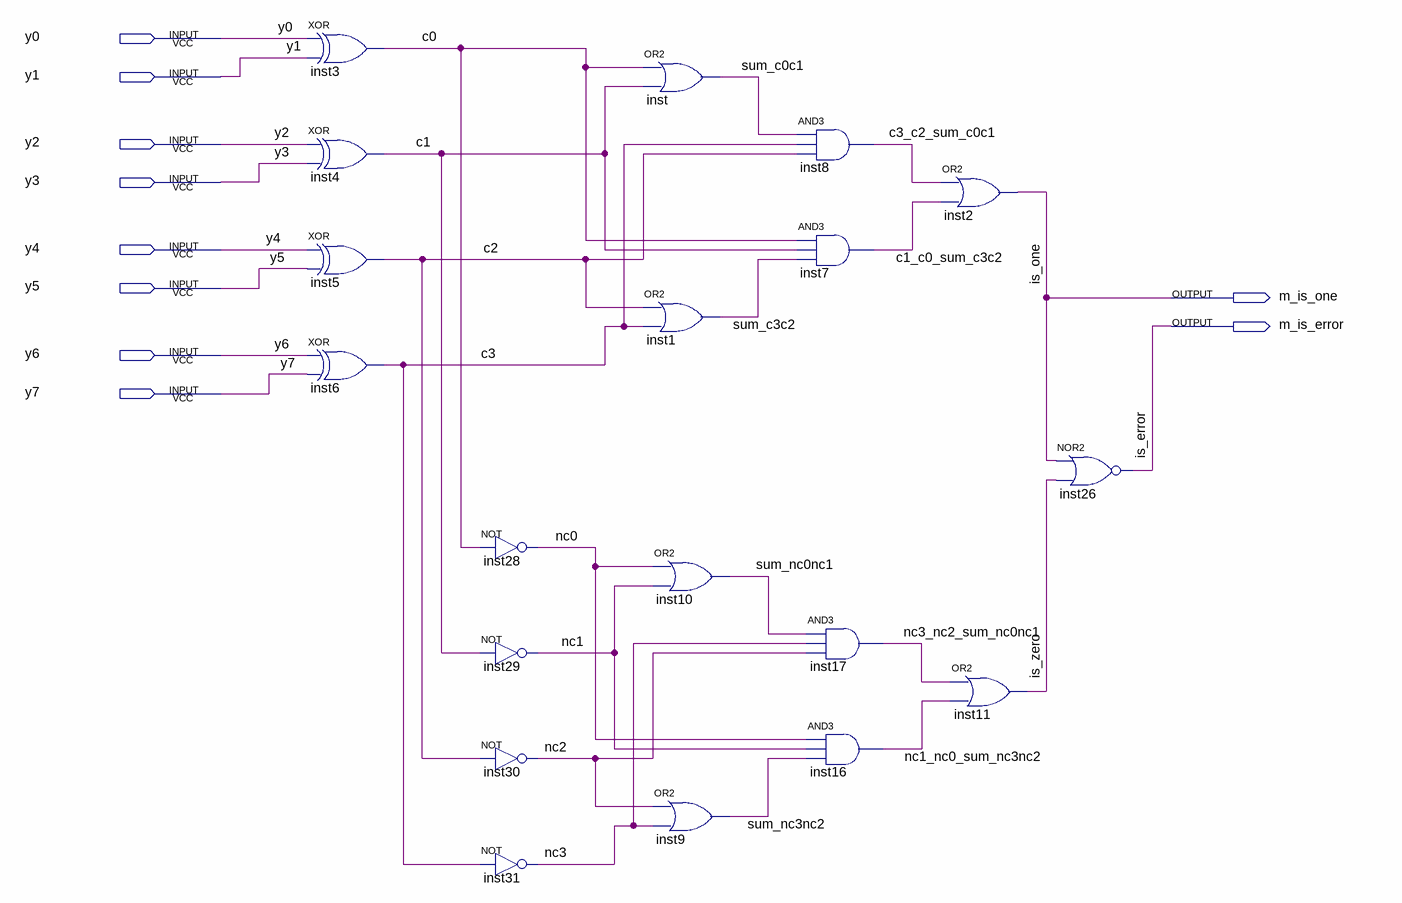
[diagram p0: schematic sheet]
// Quartus schematic m_bit_decoder.bdf as structural Verilog: 19 symbols, 10 pins
module m_bit_decoder (
  input  y0,
  input  y1,
  input  y2,
  input  y3,
  input  y4,
  input  y5,
  input  y6,
  input  y7,
  output m_is_one,
  output m_is_error
);

  wire c0, c1, c1_c0_sum_c3c2, c2, c3, c3_c2_sum_c0c1, is_zero, nc0, nc1, nc1_nc0_sum_nc3nc2, nc2, nc3,
       nc3_nc2_sum_nc0nc1, sum_c0c1, sum_c3c2, sum_nc0nc1, sum_nc3nc2;

  xor inst3 (c0, y0, y1);
  xor inst4 (c1, y2, y3);
  xor inst5 (c2, y4, y5);
  xor inst6 (c3, y6, y7);
  not inst28 (nc0, c0);
  not inst29 (nc1, c1);
  not inst30 (nc2, c2);
  not inst31 (nc3, c3);
  or inst (sum_c0c1, c0, c1);
  or inst1 (sum_c3c2, c2, c3);
  or inst10 (sum_nc0nc1, nc0, nc1);
  or inst9 (sum_nc3nc2, nc2, nc3);
  and inst8 (c3_c2_sum_c0c1, sum_c0c1, c3, c2);
  and inst7 (c1_c0_sum_c3c2, c0, c1, sum_c3c2);
  and inst17 (nc3_nc2_sum_nc0nc1, sum_nc0nc1, nc3, nc2);
  and inst16 (nc1_nc0_sum_nc3nc2, nc0, nc1, sum_nc3nc2);
  or inst2 (m_is_one, c3_c2_sum_c0c1, c1_c0_sum_c3c2);
  or inst11 (is_zero, nc3_nc2_sum_nc0nc1, nc1_nc0_sum_nc3nc2);
  nor inst26 (m_is_error, m_is_one, is_zero);

  // Other names for the same wires on the sheet: is_error = m_is_error; is_one = m_is_one
endmodule
